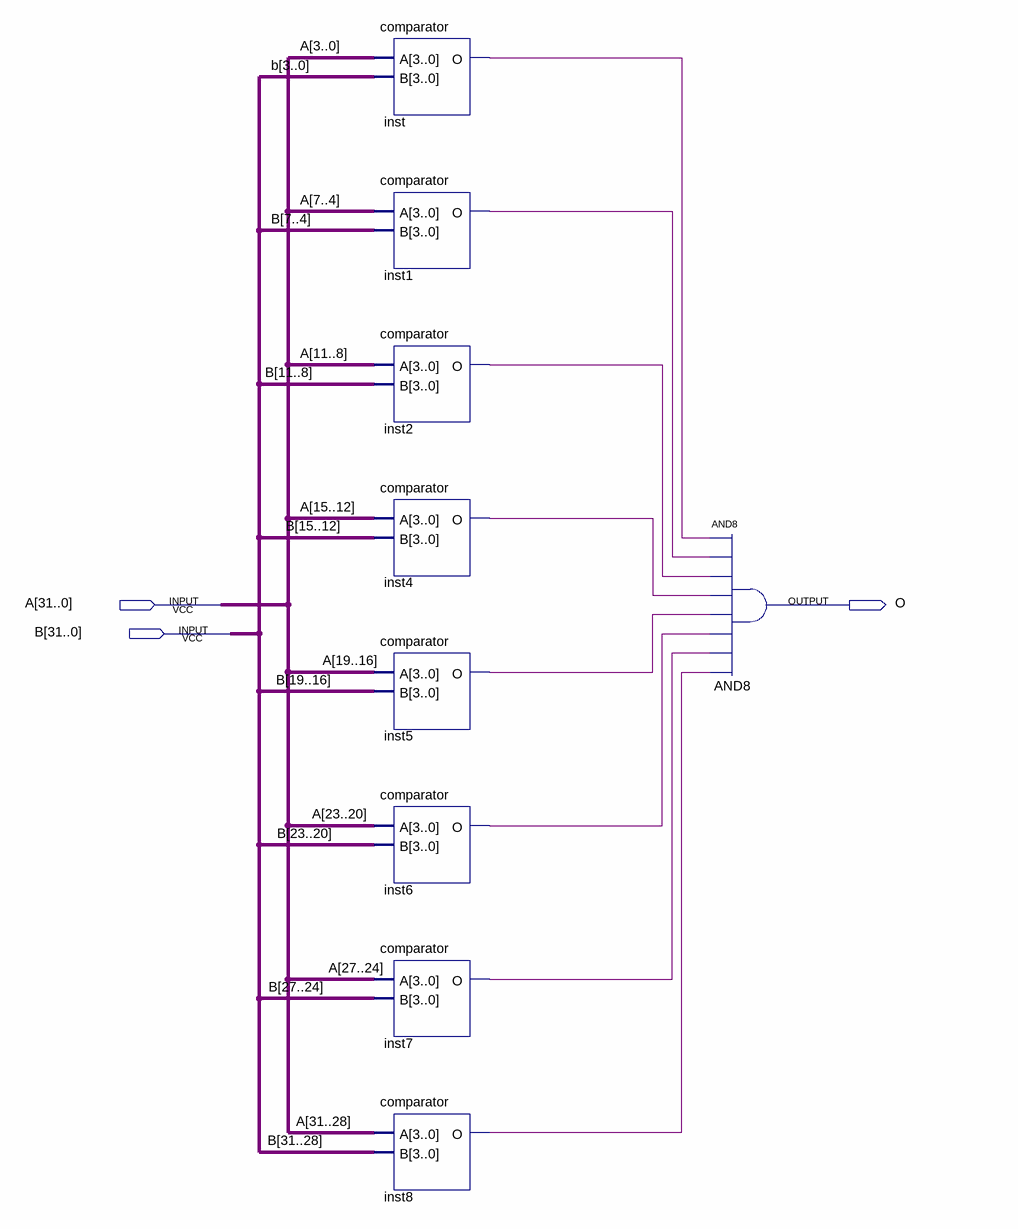
[diagram p0: schematic sheet]
// Quartus schematic thirtytwocomp.bdf as structural Verilog: 9 symbols, 3 pins
module thirtytwocomp (
  input  [31:0] A,
  input  [31:0] B,
  output O
);

  wire inst1_o, inst2_o, inst4_o, inst5_o, inst6_o, inst7_o, inst8_o, inst_o;

  comparator inst (.A(A[3:0]), .B(B[3:0]), .O(inst_o));
  comparator inst1 (.A(A[7:4]), .B(B[7:4]), .O(inst1_o));
  comparator inst2 (.A(A[11:8]), .B(B[11:8]), .O(inst2_o));
  comparator inst4 (.A(A[15:12]), .B(B[15:12]), .O(inst4_o));
  comparator inst5 (.A(A[19:16]), .B(B[19:16]), .O(inst5_o));
  comparator inst6 (.A(A[23:20]), .B(B[23:20]), .O(inst6_o));
  comparator inst7 (.A(A[27:24]), .B(B[27:24]), .O(inst7_o));
  comparator inst8 (.A(A[31:28]), .B(B[31:28]), .O(inst8_o));
  and AND8 (O, inst_o, inst1_o, inst2_o, inst4_o, inst5_o, inst6_o, inst7_o, inst8_o);
endmodule
